# EAGLE board Luminant Display Rev. 2.0 Build 5 (FINAL) (EAGLE 6.4), part 1 of 13
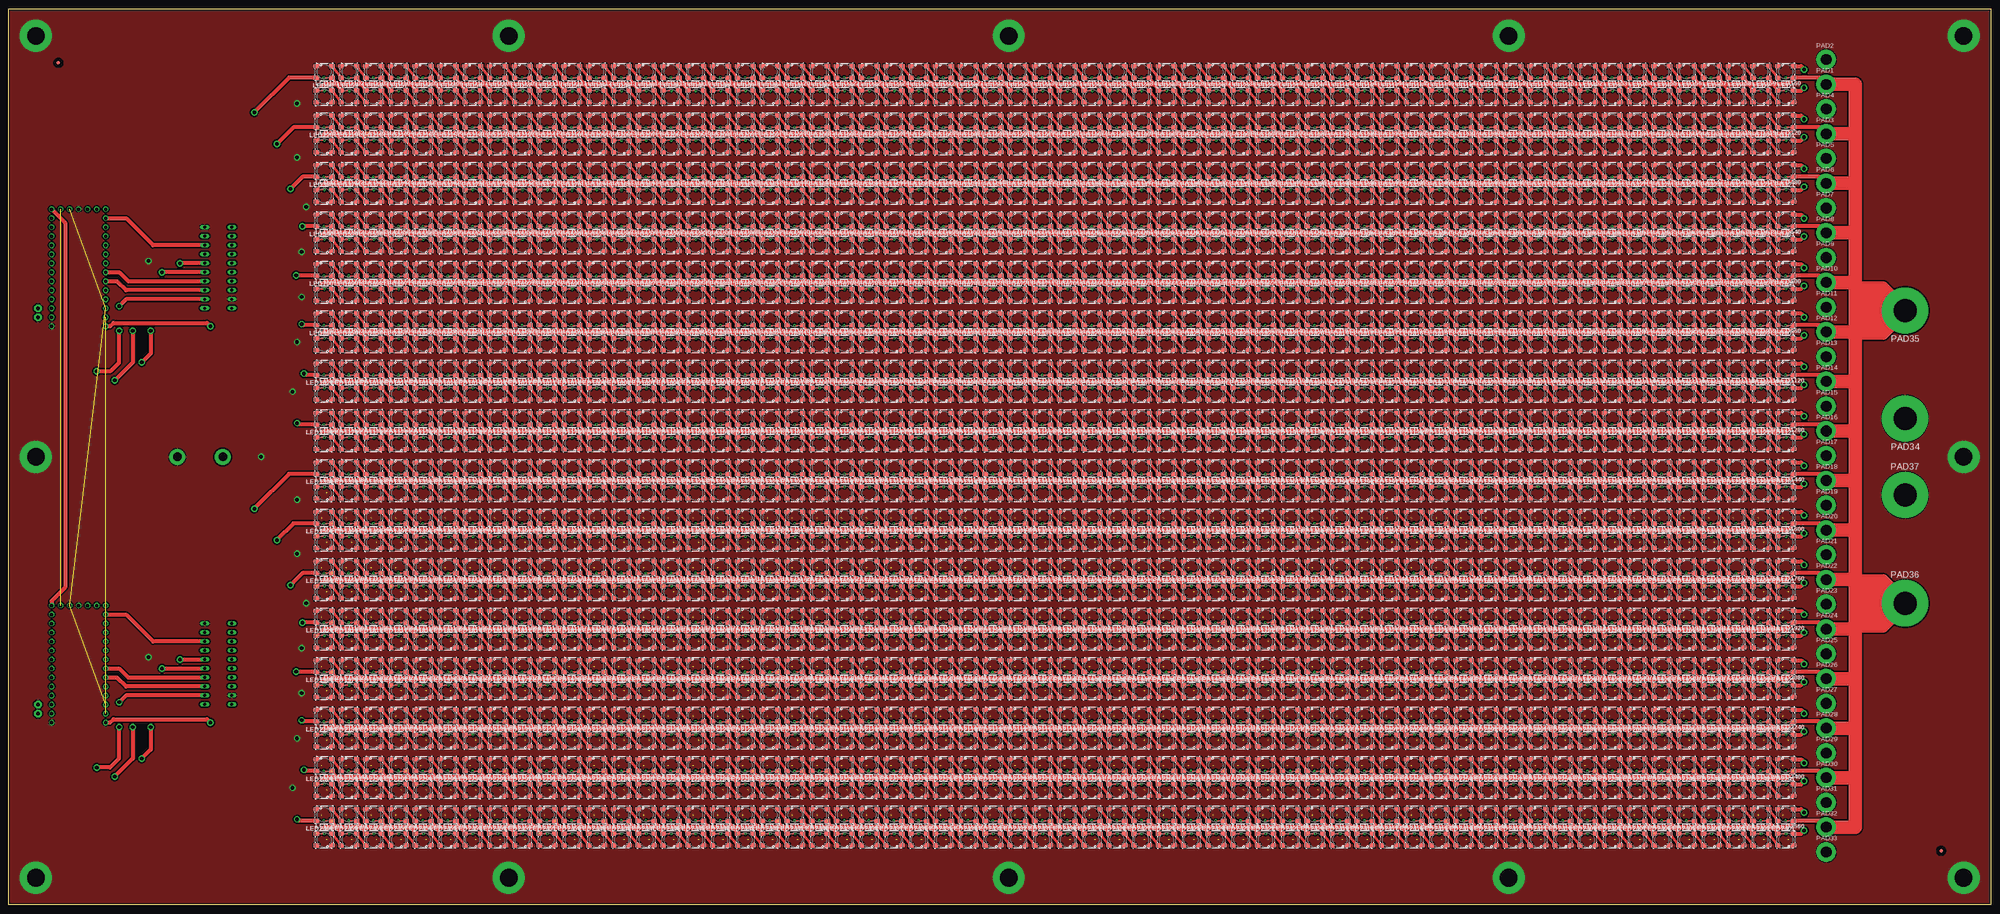
[diagram p9: board, top side]
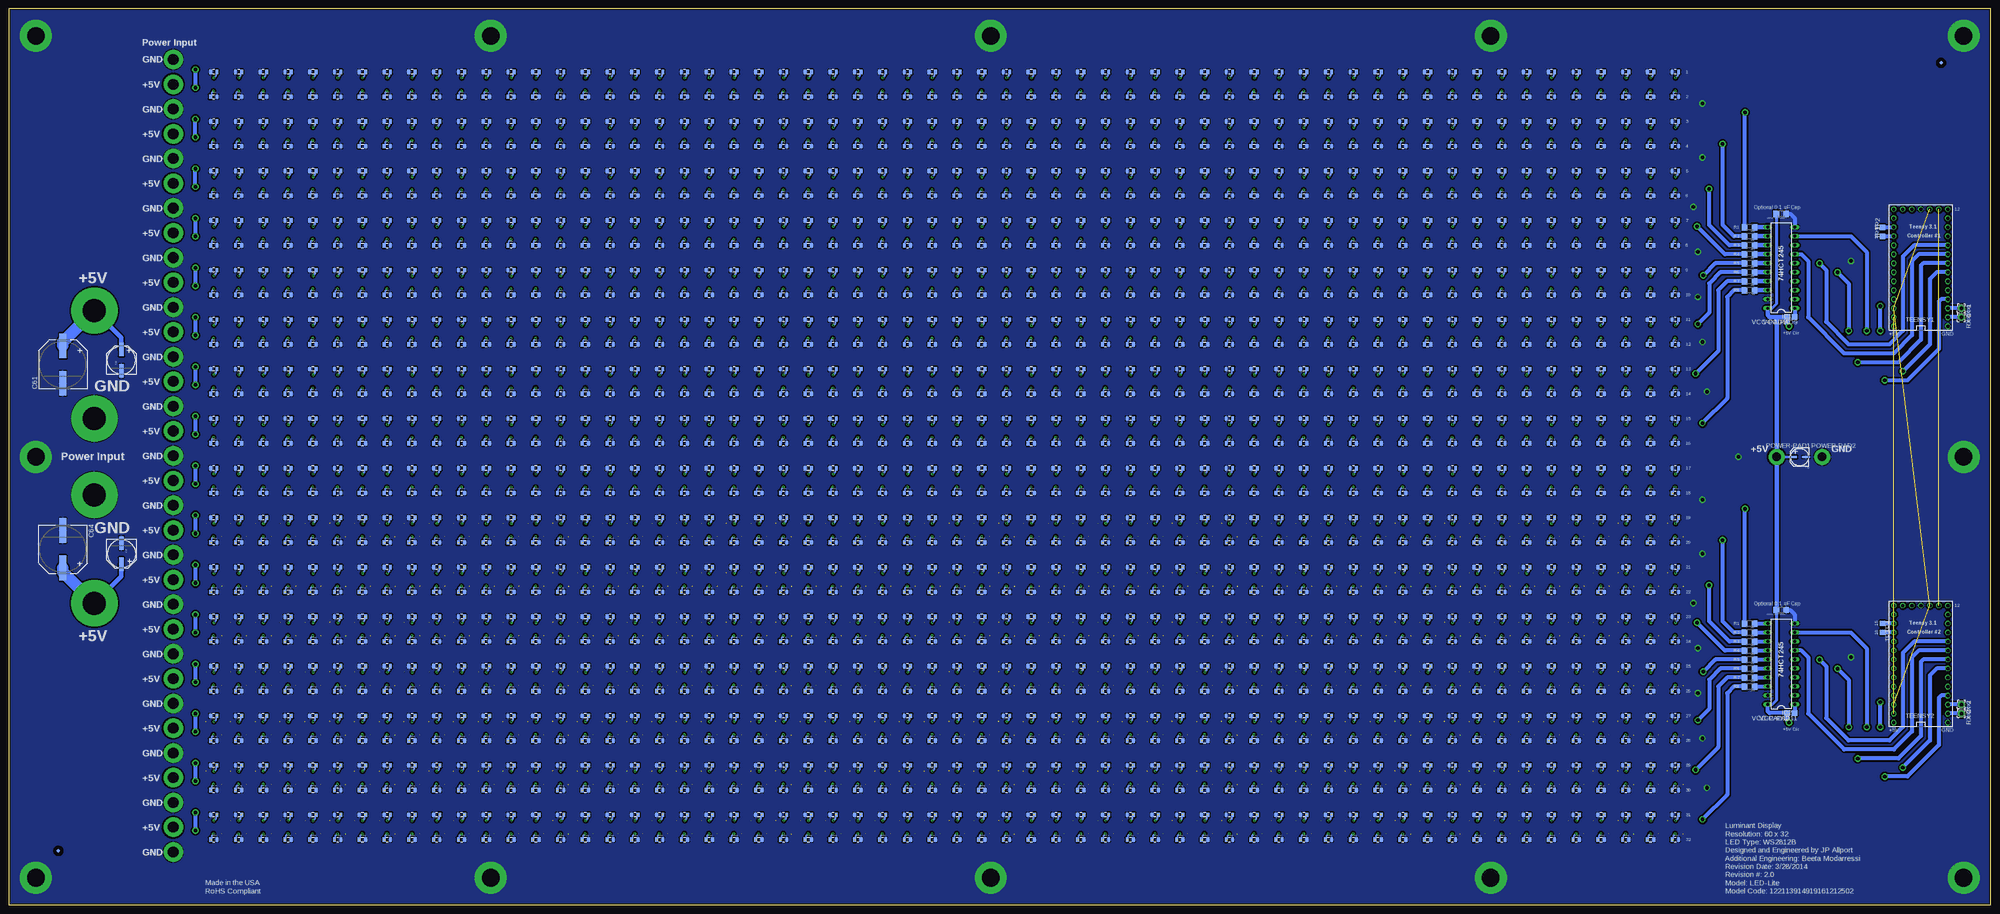
[diagram p10: board, bottom side, seen from below]

Size 558.8 x 252.73 mm. Coordinates in mm from the lower left corner, seen from the top.
Outline: 0,0 0,252.73 558.8,252.73 558.8,0 0,0
Copper layers (1*16): Top 0.035mm / dielectric 1.5mm / Bottom 0.035mm
Design rules "default *": minimum track width 10mil, minimum drill 10mil, track to track 14mil, track to pad 8mil, pad to pad 8mil, via to via 8mil, smd to smd 8mil, copper to edge 10mil, drill to drill 10mil, minimum pad ring 10mil, minimum via ring 8mil, stop-mask expansion 2mil, vias tented up to drill 0mil, thermal gap 10mil

## Footprints (pad centres in the part's own frame; a part is rotated, then mirrored left to right if it is on the bottom)
0805 = smd 0.8 x 1.2: 1 -0.9,0; 2 0.9,0
PANASONIC_FK_V_H = smd 7 x 2: + 5.3,0; - -5.3,0
PANASONIC_E = smd 3.8 x 1.4: + 3,0; - -3,0
PANASONIC_C = smd 2.2 x 0.65: + 1.9,-0.2; - -1.8,-0.2
1206 = smd 1.6 x 1.8: 1 -1.4,0; 2 1.4,0
DIL20 = drill 0.813 long: 1 -11.43,-3.81; 2 -8.89,-3.81; 3 -6.35,-3.81; 4 -3.81,-3.81; 5 -1.27,-3.81; 6 1.27,-3.81; 7 3.81,-3.81; 8 6.35,-3.81; 9 8.89,-3.81; 10 11.43,-3.81; 11 11.43,3.81; 12 8.89,3.81; 13 6.35,3.81; 14 3.81,3.81; 15 1.27,3.81; 16 -1.27,3.81; 17 -3.81,3.81; 18 -6.35,3.81; 19 -8.89,3.81; 20 -11.43,3.81
LED-WS2812B = smd 1.46 x 1.125: 1 -2.197,1.624; 2 -2.197,-1.624; 3 2.197,-1.624; 4 2.197,1.624
250,100 = drill 3 pad 5.5: 1 0,0
1000,400 = drill 6.5 pad 13: 1 0,0
125,50 = drill 2.413 pad 4.572: 1 0,0
2,15/1,0 = drill 1.016 pad 2.159 octagon: 1 0,0
TEENSY_3.1_BASIC = drill 0.965: 0 -7.62,13.97; 1 -7.62,11.43; 2 -7.62,8.89; 3 -7.62,6.35; 3.3V 7.62,11.43; 3.3V1 -2.54,-16.51; 4 -7.62,3.81; 5 -7.62,1.27; 6 -7.62,-1.27; 7 -7.62,-3.81; 8 -7.62,-6.35; 9 -7.62,-8.89; 10 -7.62,-11.43; 11 -7.62,-13.97; 12 -7.62,-16.51; 13 7.62,-16.51; 14/A0 7.62,-13.97; 15/A1 7.62,-11.43; 16/A2 7.62,-8.89; 17/A3 7.62,-6.35; 18/A4 7.62,-3.81; 19/A5 7.62,-1.27; 20/A6 7.62,1.27; 21/A7 7.62,3.81; 22/A8 7.62,6.35; 23/A9 7.62,8.89; A14 5.08,-16.51; AGND 7.62,13.97; GND -7.62,16.51; GND1 0,-16.51; PGM 2.54,-16.51; VBAT -5.08,-16.51; VIN 7.62,16.51
TP15SQ = smd 1.5 x 1.5: TP 0,0
FIDUCIAL_1MM = smd 1 x 1: 1 0,0

## Placement (x,y rotation side)
C1  0.1uF  [0805]  501.01,234.95 180 bottom
C2  0.1uF  [0805]  494.03,234.95 180 bottom
C3  0.1uF  [0805]  487.05,234.95 180 bottom
C4  0.1uF  [0805]  480.06,234.95 180 bottom
C5  0.1uF  [0805]  473.07,234.95 180 bottom
C6  0.1uF  [0805]  466.09,234.95 180 bottom
C7  0.1uF  [0805]  459.11,234.95 180 bottom
C8  0.1uF  [0805]  452.12,234.95 180 bottom
C9  0.1uF  [0805]  445.13,234.95 180 bottom
C10  0.1uF  [0805]  438.15,234.95 180 bottom
C11  0.1uF  [0805]  431.17,234.95 180 bottom
C12  0.1uF  [0805]  424.18,234.95 180 bottom
C13  0.1uF  [0805]  417.19,234.95 180 bottom
C14  0.1uF  [0805]  410.21,234.95 180 bottom
C15  0.1uF  [0805]  403.23,234.95 180 bottom
C16  0.1uF  [0805]  396.24,234.95 180 bottom
C17  0.1uF  [0805]  389.25,234.95 180 bottom
C18  0.1uF  [0805]  382.27,234.95 180 bottom
C19  0.1uF  [0805]  375.29,234.95 180 bottom
C20  0.1uF  [0805]  368.3,234.95 180 bottom
C21  0.1uF  [0805]  361.31,234.95 180 bottom
C22  0.1uF  [0805]  354.33,234.95 180 bottom
C23  0.1uF  [0805]  347.35,234.95 180 bottom
C24  0.1uF  [0805]  340.36,234.95 180 bottom
C25  0.1uF  [0805]  333.38,234.95 180 bottom
C26  0.1uF  [0805]  326.39,234.95 180 bottom
C27  0.1uF  [0805]  319.4,234.95 180 bottom
C28  0.1uF  [0805]  312.42,234.95 180 bottom
C29  0.1uF  [0805]  305.44,234.95 180 bottom
C30  0.1uF  [0805]  298.45,234.95 180 bottom
C31  0.1uF  [0805]  291.46,234.95 180 bottom
C32  0.1uF  [0805]  284.48,234.95 180 bottom
C33  0.1uF  [0805]  277.5,234.95 180 bottom
C34  0.1uF  [0805]  270.51,234.95 180 bottom
C35  0.1uF  [0805]  263.52,234.95 180 bottom
C36  0.1uF  [0805]  256.54,234.95 180 bottom
C37  0.1uF  [0805]  249.56,234.95 180 bottom
C38  0.1uF  [0805]  242.57,234.95 180 bottom
C39  0.1uF  [0805]  235.59,234.95 180 bottom
C40  0.1uF  [0805]  228.6,234.95 180 bottom
C41  0.1uF  [0805]  221.62,234.95 180 bottom
C42  0.1uF  [0805]  214.63,234.95 180 bottom
C43  0.1uF  [0805]  207.65,234.95 180 bottom
C44  0.1uF  [0805]  200.66,234.95 180 bottom
C45  0.1uF  [0805]  193.68,234.95 180 bottom
C46  0.1uF  [0805]  186.69,234.95 180 bottom
C47  0.1uF  [0805]  179.71,234.95 180 bottom
C48  0.1uF  [0805]  172.72,234.95 180 bottom
C49  0.1uF  [0805]  165.74,234.95 180 bottom
C50  0.1uF  [0805]  158.75,234.95 180 bottom
C51  0.1uF  [0805]  151.76,234.95 180 bottom
C52  0.1uF  [0805]  144.78,234.95 180 bottom
C53  0.1uF  [0805]  137.79,234.95 180 bottom
C54  0.1uF  [0805]  130.81,234.95 180 bottom
C55  0.1uF  [0805]  123.83,234.95 180 bottom
C56  0.1uF  [0805]  116.84,234.95 180 bottom
C57  0.1uF  [0805]  109.86,234.95 180 bottom
C58  0.1uF  [0805]  102.87,234.95 180 bottom
C59  0.1uF  [0805]  95.89,234.95 180 bottom
C60  0.1uF  [0805]  88.9,234.95 180 bottom
C61  [PANASONIC_FK_V_H]  543.56,152.4 90 bottom
C62  [PANASONIC_E]  527.05,153.67 90 bottom
C63  [PANASONIC_E]  527.05,99.06 270 bottom
C64  [PANASONIC_FK_V_H]  543.56,100.33 270 bottom
C65  [PANASONIC_C]  53.85,126.11 180 bottom
C101  0.1uF  [0805]  88.9,227.97 0 bottom
C102  0.1uF  [0805]  95.89,227.97 0 bottom
C103  0.1uF  [0805]  102.87,227.97 0 bottom
C104  0.1uF  [0805]  109.86,227.97 0 bottom
C105  0.1uF  [0805]  116.84,227.97 0 bottom
C106  0.1uF  [0805]  123.83,227.97 0 bottom
C107  0.1uF  [0805]  130.81,227.97 0 bottom
C108  0.1uF  [0805]  137.79,227.97 0 bottom
C109  0.1uF  [0805]  144.78,227.97 0 bottom
C110  0.1uF  [0805]  151.76,227.97 0 bottom
C111  0.1uF  [0805]  158.75,227.97 0 bottom
C112  0.1uF  [0805]  165.74,227.97 0 bottom
C113  0.1uF  [0805]  172.72,227.97 0 bottom
C114  0.1uF  [0805]  179.71,227.97 0 bottom
C115  0.1uF  [0805]  186.69,227.97 0 bottom
C116  0.1uF  [0805]  193.68,227.97 0 bottom
C117  0.1uF  [0805]  200.66,227.97 0 bottom
C118  0.1uF  [0805]  207.65,227.97 0 bottom
C119  0.1uF  [0805]  214.63,227.97 0 bottom
C120  0.1uF  [0805]  221.62,227.97 0 bottom
C121  0.1uF  [0805]  228.6,227.97 0 bottom
C122  0.1uF  [0805]  235.59,227.97 0 bottom
C123  0.1uF  [0805]  242.57,227.97 0 bottom
C124  0.1uF  [0805]  249.56,227.97 0 bottom
C125  0.1uF  [0805]  256.54,227.97 0 bottom
C126  0.1uF  [0805]  263.52,227.97 0 bottom
C127  0.1uF  [0805]  270.51,227.97 0 bottom
C128  0.1uF  [0805]  277.5,227.97 0 bottom
C129  0.1uF  [0805]  284.48,227.97 0 bottom
C130  0.1uF  [0805]  291.46,227.97 0 bottom
C131  0.1uF  [0805]  298.45,227.97 0 bottom
C132  0.1uF  [0805]  305.44,227.97 0 bottom
C133  0.1uF  [0805]  312.42,227.97 0 bottom
C134  0.1uF  [0805]  319.4,227.97 0 bottom
C135  0.1uF  [0805]  326.39,227.97 0 bottom
C136  0.1uF  [0805]  333.38,227.97 0 bottom
C137  0.1uF  [0805]  340.36,227.97 0 bottom
C138  0.1uF  [0805]  347.35,227.97 0 bottom
C139  0.1uF  [0805]  354.33,227.97 0 bottom
C140  0.1uF  [0805]  361.31,227.97 0 bottom
C141  0.1uF  [0805]  368.3,227.97 0 bottom
C142  0.1uF  [0805]  375.29,227.97 0 bottom
C143  0.1uF  [0805]  382.27,227.97 0 bottom
C144  0.1uF  [0805]  389.25,227.97 0 bottom
C145  0.1uF  [0805]  396.24,227.97 0 bottom
C146  0.1uF  [0805]  403.23,227.97 0 bottom
C147  0.1uF  [0805]  410.21,227.97 0 bottom
C148  0.1uF  [0805]  417.19,227.97 0 bottom
C149  0.1uF  [0805]  424.18,227.97 0 bottom
C150  0.1uF  [0805]  431.17,227.97 0 bottom
C151  0.1uF  [0805]  438.15,227.97 0 bottom
C152  0.1uF  [0805]  445.13,227.97 0 bottom
C153  0.1uF  [0805]  452.12,227.97 0 bottom
C154  0.1uF  [0805]  459.11,227.97 0 bottom
C155  0.1uF  [0805]  466.09,227.97 0 bottom
C156  0.1uF  [0805]  473.07,227.97 0 bottom
C157  0.1uF  [0805]  480.06,227.97 0 bottom
C158  0.1uF  [0805]  487.05,227.97 0 bottom
C159  0.1uF  [0805]  494.03,227.97 0 bottom
C160  0.1uF  [0805]  501.01,227.97 0 bottom
C161  0.1uF  [0805]  501.01,220.98 180 bottom
C162  0.1uF  [0805]  494.03,220.98 180 bottom
C163  0.1uF  [0805]  487.05,220.98 180 bottom
C164  0.1uF  [0805]  480.06,220.98 180 bottom
C165  0.1uF  [0805]  473.07,220.98 180 bottom
C166  0.1uF  [0805]  466.09,220.98 180 bottom
C167  0.1uF  [0805]  459.11,220.98 180 bottom
C168  0.1uF  [0805]  452.12,220.98 180 bottom
C169  0.1uF  [0805]  445.13,220.98 180 bottom
C170  0.1uF  [0805]  438.15,220.98 180 bottom
C171  0.1uF  [0805]  431.17,220.98 180 bottom
C172  0.1uF  [0805]  424.18,220.98 180 bottom
C173  0.1uF  [0805]  417.19,220.98 180 bottom
C174  0.1uF  [0805]  410.21,220.98 180 bottom
C175  0.1uF  [0805]  403.23,220.98 180 bottom
C176  0.1uF  [0805]  396.24,220.98 180 bottom
C177  0.1uF  [0805]  389.25,220.98 180 bottom
C178  0.1uF  [0805]  382.27,220.98 180 bottom
C179  0.1uF  [0805]  375.29,220.98 180 bottom
C180  0.1uF  [0805]  368.3,220.98 180 bottom
C181  0.1uF  [0805]  361.31,220.98 180 bottom
C182  0.1uF  [0805]  354.33,220.98 180 bottom
C183  0.1uF  [0805]  347.35,220.98 180 bottom
C184  0.1uF  [0805]  340.36,220.98 180 bottom
C185  0.1uF  [0805]  333.38,220.98 180 bottom
C186  0.1uF  [0805]  326.39,220.98 180 bottom
C187  0.1uF  [0805]  319.4,220.98 180 bottom
C188  0.1uF  [0805]  312.42,220.98 180 bottom
C189  0.1uF  [0805]  305.44,220.98 180 bottom
C190  0.1uF  [0805]  298.45,220.98 180 bottom
C191  0.1uF  [0805]  291.46,220.98 180 bottom
C192  0.1uF  [0805]  284.48,220.98 180 bottom
C193  0.1uF  [0805]  277.5,220.98 180 bottom
C194  0.1uF  [0805]  270.51,220.98 180 bottom
C195  0.1uF  [0805]  263.52,220.98 180 bottom
C196  0.1uF  [0805]  256.54,220.98 180 bottom
C197  0.1uF  [0805]  249.56,220.98 180 bottom
C198  0.1uF  [0805]  242.57,220.98 180 bottom
C199  0.1uF  [0805]  235.59,220.98 180 bottom
C200  0.1uF  [0805]  228.6,220.98 180 bottom
C201  0.1uF  [0805]  221.62,220.98 180 bottom
C202  0.1uF  [0805]  214.63,220.98 180 bottom
C203  0.1uF  [0805]  207.65,220.98 180 bottom
C204  0.1uF  [0805]  200.66,220.98 180 bottom
C205  0.1uF  [0805]  193.68,220.98 180 bottom
C206  0.1uF  [0805]  186.69,220.98 180 bottom
C207  0.1uF  [0805]  179.71,220.98 180 bottom
C208  0.1uF  [0805]  172.72,220.98 180 bottom
C209  0.1uF  [0805]  165.74,220.98 180 bottom
C210  0.1uF  [0805]  158.75,220.98 180 bottom
C211  0.1uF  [0805]  151.76,220.98 180 bottom
C212  0.1uF  [0805]  144.78,220.98 180 bottom
C213  0.1uF  [0805]  137.79,220.98 180 bottom
C214  0.1uF  [0805]  130.81,220.98 180 bottom
C215  0.1uF  [0805]  123.83,220.98 180 bottom
C216  0.1uF  [0805]  116.84,220.98 180 bottom
C217  0.1uF  [0805]  109.86,220.98 180 bottom
C218  0.1uF  [0805]  102.87,220.98 180 bottom
C219  0.1uF  [0805]  95.89,220.98 180 bottom
C220  0.1uF  [0805]  88.9,220.98 180 bottom
C261  0.1uF  [0805]  88.9,214 0 bottom
C262  0.1uF  [0805]  95.89,214 0 bottom
C263  0.1uF  [0805]  102.87,214 0 bottom
C264  0.1uF  [0805]  109.86,214 0 bottom
C265  0.1uF  [0805]  116.84,214 0 bottom
C266  0.1uF  [0805]  123.83,214 0 bottom
C267  0.1uF  [0805]  130.81,214 0 bottom
C268  0.1uF  [0805]  137.79,214 0 bottom
C269  0.1uF  [0805]  144.78,214 0 bottom
C270  0.1uF  [0805]  151.76,214 0 bottom
C271  0.1uF  [0805]  158.75,214 0 bottom
C272  0.1uF  [0805]  165.74,214 0 bottom
C273  0.1uF  [0805]  172.72,214 0 bottom
C274  0.1uF  [0805]  179.71,214 0 bottom
C275  0.1uF  [0805]  186.69,214 0 bottom
C276  0.1uF  [0805]  193.68,214 0 bottom
C277  0.1uF  [0805]  200.66,214 0 bottom
C278  0.1uF  [0805]  207.65,214 0 bottom
C279  0.1uF  [0805]  214.63,214 0 bottom
C280  0.1uF  [0805]  221.62,214 0 bottom
C281  0.1uF  [0805]  228.6,214 0 bottom
C282  0.1uF  [0805]  235.59,214 0 bottom
C283  0.1uF  [0805]  242.57,214 0 bottom
C284  0.1uF  [0805]  249.56,214 0 bottom
C285  0.1uF  [0805]  256.54,214 0 bottom
C286  0.1uF  [0805]  263.52,214 0 bottom
C287  0.1uF  [0805]  270.51,214 0 bottom
C288  0.1uF  [0805]  277.5,214 0 bottom
C289  0.1uF  [0805]  284.48,214 0 bottom
C290  0.1uF  [0805]  291.46,214 0 bottom
C291  0.1uF  [0805]  298.45,214 0 bottom
C292  0.1uF  [0805]  305.44,214 0 bottom
C293  0.1uF  [0805]  312.42,214 0 bottom
C294  0.1uF  [0805]  319.4,214 0 bottom
C295  0.1uF  [0805]  326.39,214 0 bottom
C296  0.1uF  [0805]  333.38,214 0 bottom
C297  0.1uF  [0805]  340.36,214 0 bottom
C298  0.1uF  [0805]  347.35,214 0 bottom
C299  0.1uF  [0805]  354.33,214 0 bottom
C300  0.1uF  [0805]  361.31,214 0 bottom
C301  0.1uF  [0805]  368.3,214 0 bottom
C302  0.1uF  [0805]  375.29,214 0 bottom
C303  0.1uF  [0805]  382.27,214 0 bottom
C304  0.1uF  [0805]  389.25,214 0 bottom
C305  0.1uF  [0805]  396.24,214 0 bottom
C306  0.1uF  [0805]  403.23,214 0 bottom
C307  0.1uF  [0805]  410.21,214 0 bottom
C308  0.1uF  [0805]  417.19,214 0 bottom
C309  0.1uF  [0805]  424.18,214 0 bottom
C310  0.1uF  [0805]  431.17,214 0 bottom
C311  0.1uF  [0805]  438.15,214 0 bottom
C312  0.1uF  [0805]  445.13,214 0 bottom
C313  0.1uF  [0805]  452.12,214 0 bottom
C314  0.1uF  [0805]  459.11,214 0 bottom
C315  0.1uF  [0805]  466.09,214 0 bottom
C316  0.1uF  [0805]  473.07,214 0 bottom
C317  0.1uF  [0805]  480.06,214 0 bottom
C318  0.1uF  [0805]  487.05,214 0 bottom
C319  0.1uF  [0805]  494.03,214 0 bottom
C320  0.1uF  [0805]  501.01,214 0 bottom
C321  0.1uF  [0805]  501.01,207.01 180 bottom
C322  0.1uF  [0805]  494.03,207.01 180 bottom
C323  0.1uF  [0805]  487.05,207.01 180 bottom
C324  0.1uF  [0805]  480.06,207.01 180 bottom
C325  0.1uF  [0805]  473.07,207.01 180 bottom
C326  0.1uF  [0805]  466.09,207.01 180 bottom
C327  0.1uF  [0805]  459.11,207.01 180 bottom
C328  0.1uF  [0805]  452.12,207.01 180 bottom
C329  0.1uF  [0805]  445.13,207.01 180 bottom
C330  0.1uF  [0805]  438.15,207.01 180 bottom
C331  0.1uF  [0805]  431.17,207.01 180 bottom
C332  0.1uF  [0805]  424.18,207.01 180 bottom
C333  0.1uF  [0805]  417.19,207.01 180 bottom
C334  0.1uF  [0805]  410.21,207.01 180 bottom
C335  0.1uF  [0805]  403.23,207.01 180 bottom
C336  0.1uF  [0805]  396.24,207.01 180 bottom
C337  0.1uF  [0805]  389.25,207.01 180 bottom
C338  0.1uF  [0805]  382.27,207.01 180 bottom
C339  0.1uF  [0805]  375.29,207.01 180 bottom
C340  0.1uF  [0805]  368.3,207.01 180 bottom
C341  0.1uF  [0805]  361.31,207.01 180 bottom
C342  0.1uF  [0805]  354.33,207.01 180 bottom
C343  0.1uF  [0805]  347.35,207.01 180 bottom
C344  0.1uF  [0805]  340.36,207.01 180 bottom
C345  0.1uF  [0805]  333.38,207.01 180 bottom
C346  0.1uF  [0805]  326.39,207.01 180 bottom
C347  0.1uF  [0805]  319.4,207.01 180 bottom
C348  0.1uF  [0805]  312.42,207.01 180 bottom
C349  0.1uF  [0805]  305.44,207.01 180 bottom
C350  0.1uF  [0805]  298.45,207.01 180 bottom
C351  0.1uF  [0805]  291.46,207.01 180 bottom
C352  0.1uF  [0805]  284.48,207.01 180 bottom
C353  0.1uF  [0805]  277.5,207.01 180 bottom
C354  0.1uF  [0805]  270.51,207.01 180 bottom
C355  0.1uF  [0805]  263.52,207.01 180 bottom
C356  0.1uF  [0805]  256.54,207.01 180 bottom
C357  0.1uF  [0805]  249.56,207.01 180 bottom
C358  0.1uF  [0805]  242.57,207.01 180 bottom
C359  0.1uF  [0805]  235.59,207.01 180 bottom
C360  0.1uF  [0805]  228.6,207.01 180 bottom
C361  0.1uF  [0805]  221.62,207.01 180 bottom
C362  0.1uF  [0805]  214.63,207.01 180 bottom
C363  0.1uF  [0805]  207.65,207.01 180 bottom
C364  0.1uF  [0805]  200.66,207.01 180 bottom
C365  0.1uF  [0805]  193.68,207.01 180 bottom
C366  0.1uF  [0805]  186.69,207.01 180 bottom
C367  0.1uF  [0805]  179.71,207.01 180 bottom
C368  0.1uF  [0805]  172.72,207.01 180 bottom
C369  0.1uF  [0805]  165.74,207.01 180 bottom
C370  0.1uF  [0805]  158.75,207.01 180 bottom
C371  0.1uF  [0805]  151.76,207.01 180 bottom
C372  0.1uF  [0805]  144.78,207.01 180 bottom
C373  0.1uF  [0805]  137.79,207.01 180 bottom
C374  0.1uF  [0805]  130.81,207.01 180 bottom
C375  0.1uF  [0805]  123.83,207.01 180 bottom
C376  0.1uF  [0805]  116.84,207.01 180 bottom
C377  0.1uF  [0805]  109.86,207.01 180 bottom
C378  0.1uF  [0805]  102.87,207.01 180 bottom
C379  0.1uF  [0805]  95.89,207.01 180 bottom
C380  0.1uF  [0805]  88.9,207.01 180 bottom
C421  0.1uF  [0805]  88.9,200.03 0 bottom
C422  0.1uF  [0805]  95.89,200.03 0 bottom
C423  0.1uF  [0805]  102.87,200.03 0 bottom
C424  0.1uF  [0805]  109.86,200.03 0 bottom
C425  0.1uF  [0805]  116.84,200.03 0 bottom
C426  0.1uF  [0805]  123.83,200.03 0 bottom
C427  0.1uF  [0805]  130.81,200.03 0 bottom
C428  0.1uF  [0805]  137.79,200.03 0 bottom
C429  0.1uF  [0805]  144.78,200.03 0 bottom
C430  0.1uF  [0805]  151.76,200.03 0 bottom
C431  0.1uF  [0805]  158.75,200.03 0 bottom
C432  0.1uF  [0805]  165.74,200.03 0 bottom
C433  0.1uF  [0805]  172.72,200.03 0 bottom
C434  0.1uF  [0805]  179.71,200.03 0 bottom
C435  0.1uF  [0805]  186.69,200.03 0 bottom
C436  0.1uF  [0805]  193.68,200.03 0 bottom
C437  0.1uF  [0805]  200.66,200.03 0 bottom
C438  0.1uF  [0805]  207.65,200.03 0 bottom
C439  0.1uF  [0805]  214.63,200.03 0 bottom
C440  0.1uF  [0805]  221.62,200.03 0 bottom
C441  0.1uF  [0805]  228.6,200.03 0 bottom
C442  0.1uF  [0805]  235.59,200.03 0 bottom
C443  0.1uF  [0805]  242.57,200.03 0 bottom
C444  0.1uF  [0805]  249.56,200.03 0 bottom
C445  0.1uF  [0805]  256.54,200.03 0 bottom
C446  0.1uF  [0805]  263.52,200.03 0 bottom
C447  0.1uF  [0805]  270.51,200.03 0 bottom
C448  0.1uF  [0805]  277.5,200.03 0 bottom
C449  0.1uF  [0805]  284.48,200.03 0 bottom
C450  0.1uF  [0805]  291.46,200.03 0 bottom
C451  0.1uF  [0805]  298.45,200.03 0 bottom
C452  0.1uF  [0805]  305.44,200.03 0 bottom
C453  0.1uF  [0805]  312.42,200.03 0 bottom
C454  0.1uF  [0805]  319.4,200.03 0 bottom
C455  0.1uF  [0805]  326.39,200.03 0 bottom
C456  0.1uF  [0805]  333.38,200.03 0 bottom
C457  0.1uF  [0805]  340.36,200.03 0 bottom
C458  0.1uF  [0805]  347.35,200.03 0 bottom
C459  0.1uF  [0805]  354.33,200.03 0 bottom
C460  0.1uF  [0805]  361.31,200.03 0 bottom
C461  0.1uF  [0805]  368.3,200.03 0 bottom
C462  0.1uF  [0805]  375.29,200.03 0 bottom
C463  0.1uF  [0805]  382.27,200.03 0 bottom
C464  0.1uF  [0805]  389.25,200.03 0 bottom
C465  0.1uF  [0805]  396.24,200.03 0 bottom
C466  0.1uF  [0805]  403.23,200.03 0 bottom
C467  0.1uF  [0805]  410.21,200.03 0 bottom
C468  0.1uF  [0805]  417.19,200.03 0 bottom
C469  0.1uF  [0805]  424.18,200.03 0 bottom
C470  0.1uF  [0805]  431.17,200.03 0 bottom
C471  0.1uF  [0805]  438.15,200.03 0 bottom
C472  0.1uF  [0805]  445.13,200.03 0 bottom
C473  0.1uF  [0805]  452.12,200.03 0 bottom
C474  0.1uF  [0805]  459.11,200.03 0 bottom
C475  0.1uF  [0805]  466.09,200.03 0 bottom
C476  0.1uF  [0805]  473.07,200.03 0 bottom
C477  0.1uF  [0805]  480.06,200.03 0 bottom
C478  0.1uF  [0805]  487.05,200.03 0 bottom
C479  0.1uF  [0805]  494.03,200.03 0 bottom
C480  0.1uF  [0805]  501.01,200.03 0 bottom
C481  0.1uF  [0805]  501.01,193.04 180 bottom
C482  0.1uF  [0805]  494.03,193.04 180 bottom
C483  0.1uF  [0805]  487.05,193.04 180 bottom
C484  0.1uF  [0805]  480.06,193.04 180 bottom
C485  0.1uF  [0805]  473.07,193.04 180 bottom
C486  0.1uF  [0805]  466.09,193.04 180 bottom
C487  0.1uF  [0805]  459.11,193.04 180 bottom
C488  0.1uF  [0805]  452.12,193.04 180 bottom
C489  0.1uF  [0805]  445.13,193.04 180 bottom
C490  0.1uF  [0805]  438.15,193.04 180 bottom
C491  0.1uF  [0805]  431.17,193.04 180 bottom
C492  0.1uF  [0805]  424.18,193.04 180 bottom
C493  0.1uF  [0805]  417.19,193.04 180 bottom
C494  0.1uF  [0805]  410.21,193.04 180 bottom
C495  0.1uF  [0805]  403.23,193.04 180 bottom
C496  0.1uF  [0805]  396.24,193.04 180 bottom
C497  0.1uF  [0805]  389.25,193.04 180 bottom
C498  0.1uF  [0805]  382.27,193.04 180 bottom
C499  0.1uF  [0805]  375.29,193.04 180 bottom
C500  0.1uF  [0805]  368.3,193.04 180 bottom
C501  0.1uF  [0805]  361.31,193.04 180 bottom
C502  0.1uF  [0805]  354.33,193.04 180 bottom
C503  0.1uF  [0805]  347.35,193.04 180 bottom
C504  0.1uF  [0805]  340.36,193.04 180 bottom
C505  0.1uF  [0805]  333.38,193.04 180 bottom
C506  0.1uF  [0805]  326.39,193.04 180 bottom
C507  0.1uF  [0805]  319.4,193.04 180 bottom
C508  0.1uF  [0805]  312.42,193.04 180 bottom
C509  0.1uF  [0805]  305.44,193.04 180 bottom
C510  0.1uF  [0805]  298.45,193.04 180 bottom
C511  0.1uF  [0805]  291.46,193.04 180 bottom
C512  0.1uF  [0805]  284.48,193.04 180 bottom
C513  0.1uF  [0805]  277.5,193.04 180 bottom
C514  0.1uF  [0805]  270.51,193.04 180 bottom
C515  0.1uF  [0805]  263.52,193.04 180 bottom
C516  0.1uF  [0805]  256.54,193.04 180 bottom
C517  0.1uF  [0805]  249.56,193.04 180 bottom
C518  0.1uF  [0805]  242.57,193.04 180 bottom
C519  0.1uF  [0805]  235.59,193.04 180 bottom
C520  0.1uF  [0805]  228.6,193.04 180 bottom
C521  0.1uF  [0805]  221.62,193.04 180 bottom
C522  0.1uF  [0805]  214.63,193.04 180 bottom
C523  0.1uF  [0805]  207.65,193.04 180 bottom
C524  0.1uF  [0805]  200.66,193.04 180 bottom
C525  0.1uF  [0805]  193.68,193.04 180 bottom
C526  0.1uF  [0805]  186.69,193.04 180 bottom
C527  0.1uF  [0805]  179.71,193.04 180 bottom
C528  0.1uF  [0805]  172.72,193.04 180 bottom
C529  0.1uF  [0805]  165.74,193.04 180 bottom
C530  0.1uF  [0805]  158.75,193.04 180 bottom
C531  0.1uF  [0805]  151.76,193.04 180 bottom
C532  0.1uF  [0805]  144.78,193.04 180 bottom
C533  0.1uF  [0805]  137.79,193.04 180 bottom
C534  0.1uF  [0805]  130.81,193.04 180 bottom
C535  0.1uF  [0805]  123.83,193.04 180 bottom
C536  0.1uF  [0805]  116.84,193.04 180 bottom
C537  0.1uF  [0805]  109.86,193.04 180 bottom
C538  0.1uF  [0805]  102.87,193.04 180 bottom
C539  0.1uF  [0805]  95.89,193.04 180 bottom
C540  0.1uF  [0805]  88.9,193.04 180 bottom
C581  0.1uF  [0805]  88.9,186.06 0 bottom
C582  0.1uF  [0805]  95.89,186.06 0 bottom
C583  0.1uF  [0805]  102.87,186.06 0 bottom
C584  0.1uF  [0805]  109.86,186.06 0 bottom
C585  0.1uF  [0805]  116.84,186.06 0 bottom
C586  0.1uF  [0805]  123.83,186.06 0 bottom
C587  0.1uF  [0805]  130.81,186.06 0 bottom
C588  0.1uF  [0805]  137.79,186.06 0 bottom
C589  0.1uF  [0805]  144.78,186.06 0 bottom
C590  0.1uF  [0805]  151.76,186.06 0 bottom
C591  0.1uF  [0805]  158.75,186.06 0 bottom
C592  0.1uF  [0805]  165.74,186.06 0 bottom
C593  0.1uF  [0805]  172.72,186.06 0 bottom
C594  0.1uF  [0805]  179.71,186.06 0 bottom
C595  0.1uF  [0805]  186.69,186.06 0 bottom
C596  0.1uF  [0805]  193.68,186.06 0 bottom
C597  0.1uF  [0805]  200.66,186.06 0 bottom
C598  0.1uF  [0805]  207.65,186.06 0 bottom
C599  0.1uF  [0805]  214.63,186.06 0 bottom
C600  0.1uF  [0805]  221.62,186.06 0 bottom
C601  0.1uF  [0805]  228.6,186.06 0 bottom
C602  0.1uF  [0805]  235.59,186.06 0 bottom
C603  0.1uF  [0805]  242.57,186.06 0 bottom
C604  0.1uF  [0805]  249.56,186.06 0 bottom
C605  0.1uF  [0805]  256.54,186.06 0 bottom
C606  0.1uF  [0805]  263.52,186.06 0 bottom
C607  0.1uF  [0805]  270.51,186.06 0 bottom
C608  0.1uF  [0805]  277.5,186.06 0 bottom
C609  0.1uF  [0805]  284.48,186.06 0 bottom
C610  0.1uF  [0805]  291.46,186.06 0 bottom
C611  0.1uF  [0805]  298.45,186.06 0 bottom
C612  0.1uF  [0805]  305.44,186.06 0 bottom
C613  0.1uF  [0805]  312.42,186.06 0 bottom
C614  0.1uF  [0805]  319.4,186.06 0 bottom
C615  0.1uF  [0805]  326.39,186.06 0 bottom
C616  0.1uF  [0805]  333.38,186.06 0 bottom
C617  0.1uF  [0805]  340.36,186.06 0 bottom
C618  0.1uF  [0805]  347.35,186.06 0 bottom
C619  0.1uF  [0805]  354.33,186.06 0 bottom
C620  0.1uF  [0805]  361.31,186.06 0 bottom
C621  0.1uF  [0805]  368.3,186.06 0 bottom
C622  0.1uF  [0805]  375.29,186.06 0 bottom
C623  0.1uF  [0805]  382.27,186.06 0 bottom
C624  0.1uF  [0805]  389.25,186.06 0 bottom
C625  0.1uF  [0805]  396.24,186.06 0 bottom
C626  0.1uF  [0805]  403.23,186.06 0 bottom
C627  0.1uF  [0805]  410.21,186.06 0 bottom
C628  0.1uF  [0805]  417.19,186.06 0 bottom
C629  0.1uF  [0805]  424.18,186.06 0 bottom
C630  0.1uF  [0805]  431.17,186.06 0 bottom
C631  0.1uF  [0805]  438.15,186.06 0 bottom
C632  0.1uF  [0805]  445.13,186.06 0 bottom
C633  0.1uF  [0805]  452.12,186.06 0 bottom
C634  0.1uF  [0805]  459.11,186.06 0 bottom
C635  0.1uF  [0805]  466.09,186.06 0 bottom
C636  0.1uF  [0805]  473.07,186.06 0 bottom
C637  0.1uF  [0805]  480.06,186.06 0 bottom
C638  0.1uF  [0805]  487.05,186.06 0 bottom
C639  0.1uF  [0805]  494.03,186.06 0 bottom
C640  0.1uF  [0805]  501.01,186.06 0 bottom
C641  0.1uF  [0805]  501.01,179.07 180 bottom
C642  0.1uF  [0805]  494.03,179.07 180 bottom
C643  0.1uF  [0805]  487.05,179.07 180 bottom
C644  0.1uF  [0805]  480.06,179.07 180 bottom
C645  0.1uF  [0805]  473.07,179.07 180 bottom
C646  0.1uF  [0805]  466.09,179.07 180 bottom
C647  0.1uF  [0805]  459.11,179.07 180 bottom
C648  0.1uF  [0805]  452.12,179.07 180 bottom
C649  0.1uF  [0805]  445.13,179.07 180 bottom
C650  0.1uF  [0805]  438.15,179.07 180 bottom
C651  0.1uF  [0805]  431.17,179.07 180 bottom
C652  0.1uF  [0805]  424.18,179.07 180 bottom
C653  0.1uF  [0805]  417.19,179.07 180 bottom
C654  0.1uF  [0805]  410.21,179.07 180 bottom
C655  0.1uF  [0805]  403.23,179.07 180 bottom
C656  0.1uF  [0805]  396.24,179.07 180 bottom
C657  0.1uF  [0805]  389.25,179.07 180 bottom
C658  0.1uF  [0805]  382.27,179.07 180 bottom
C659  0.1uF  [0805]  375.29,179.07 180 bottom
C660  0.1uF  [0805]  368.3,179.07 180 bottom
C661  0.1uF  [0805]  361.31,179.07 180 bottom
C662  0.1uF  [0805]  354.33,179.07 180 bottom
C663  0.1uF  [0805]  347.35,179.07 180 bottom
C664  0.1uF  [0805]  340.36,179.07 180 bottom
C665  0.1uF  [0805]  333.38,179.07 180 bottom
C666  0.1uF  [0805]  326.39,179.07 180 bottom
C667  0.1uF  [0805]  319.4,179.07 180 bottom
C668  0.1uF  [0805]  312.42,179.07 180 bottom
C669  0.1uF  [0805]  305.44,179.07 180 bottom
C670  0.1uF  [0805]  298.45,179.07 180 bottom
C671  0.1uF  [0805]  291.46,179.07 180 bottom
C672  0.1uF  [0805]  284.48,179.07 180 bottom
C673  0.1uF  [0805]  277.5,179.07 180 bottom
C674  0.1uF  [0805]  270.51,179.07 180 bottom
C675  0.1uF  [0805]  263.52,179.07 180 bottom
C676  0.1uF  [0805]  256.54,179.07 180 bottom
C677  0.1uF  [0805]  249.56,179.07 180 bottom
C678  0.1uF  [0805]  242.57,179.07 180 bottom
C679  0.1uF  [0805]  235.59,179.07 180 bottom
C680  0.1uF  [0805]  228.6,179.07 180 bottom
C681  0.1uF  [0805]  221.62,179.07 180 bottom
C682  0.1uF  [0805]  214.63,179.07 180 bottom
C683  0.1uF  [0805]  207.65,179.07 180 bottom
C684  0.1uF  [0805]  200.66,179.07 180 bottom
C685  0.1uF  [0805]  193.68,179.07 180 bottom
C686  0.1uF  [0805]  186.69,179.07 180 bottom
C687  0.1uF  [0805]  179.71,179.07 180 bottom
C688  0.1uF  [0805]  172.72,179.07 180 bottom
C689  0.1uF  [0805]  165.74,179.07 180 bottom
C690  0.1uF  [0805]  158.75,179.07 180 bottom
C691  0.1uF  [0805]  151.76,179.07 180 bottom
C692  0.1uF  [0805]  144.78,179.07 180 bottom
C693  0.1uF  [0805]  137.79,179.07 180 bottom
C694  0.1uF  [0805]  130.81,179.07 180 bottom
C695  0.1uF  [0805]  123.83,179.07 180 bottom
C696  0.1uF  [0805]  116.84,179.07 180 bottom
C697  0.1uF  [0805]  109.86,179.07 180 bottom
C698  0.1uF  [0805]  102.87,179.07 180 bottom
C699  0.1uF  [0805]  95.89,179.07 180 bottom
C700  0.1uF  [0805]  88.9,179.07 180 bottom
C741  0.1uF  [0805]  88.9,172.09 0 bottom
C742  0.1uF  [0805]  95.89,172.09 0 bottom
C743  0.1uF  [0805]  102.87,172.09 0 bottom
C744  0.1uF  [0805]  109.86,172.09 0 bottom
C745  0.1uF  [0805]  116.84,172.09 0 bottom
C746  0.1uF  [0805]  123.83,172.09 0 bottom
C747  0.1uF  [0805]  130.81,172.09 0 bottom
C748  0.1uF  [0805]  137.79,172.09 0 bottom
C749  0.1uF  [0805]  144.78,172.09 0 bottom
C750  0.1uF  [0805]  151.76,172.09 0 bottom
C751  0.1uF  [0805]  158.75,172.09 0 bottom
C752  0.1uF  [0805]  165.74,172.09 0 bottom
C753  0.1uF  [0805]  172.72,172.09 0 bottom
C754  0.1uF  [0805]  179.71,172.09 0 bottom
C755  0.1uF  [0805]  186.69,172.09 0 bottom
C756  0.1uF  [0805]  193.68,172.09 0 bottom
C757  0.1uF  [0805]  200.66,172.09 0 bottom
C758  0.1uF  [0805]  207.65,172.09 0 bottom
C759  0.1uF  [0805]  214.63,172.09 0 bottom
C760  0.1uF  [0805]  221.62,172.09 0 bottom
C761  0.1uF  [0805]  228.6,172.09 0 bottom
C762  0.1uF  [0805]  235.59,172.09 0 bottom
C763  0.1uF  [0805]  242.57,172.09 0 bottom
C764  0.1uF  [0805]  249.56,172.09 0 bottom
C765  0.1uF  [0805]  256.54,172.09 0 bottom
C766  0.1uF  [0805]  263.52,172.09 0 bottom
C767  0.1uF  [0805]  270.51,172.09 0 bottom
C768  0.1uF  [0805]  277.5,172.09 0 bottom
C769  0.1uF  [0805]  284.48,172.09 0 bottom
C770  0.1uF  [0805]  291.46,172.09 0 bottom
C771  0.1uF  [0805]  298.45,172.09 0 bottom
C772  0.1uF  [0805]  305.44,172.09 0 bottom
C773  0.1uF  [0805]  312.42,172.09 0 bottom
C774  0.1uF  [0805]  319.4,172.09 0 bottom
C775  0.1uF  [0805]  326.39,172.09 0 bottom
C776  0.1uF  [0805]  333.38,172.09 0 bottom
C777  0.1uF  [0805]  340.36,172.09 0 bottom
C778  0.1uF  [0805]  347.35,172.09 0 bottom
C779  0.1uF  [0805]  354.33,172.09 0 bottom
C780  0.1uF  [0805]  361.31,172.09 0 bottom
C781  0.1uF  [0805]  368.3,172.09 0 bottom
C782  0.1uF  [0805]  375.29,172.09 0 bottom
C783  0.1uF  [0805]  382.27,172.09 0 bottom
C784  0.1uF  [0805]  389.25,172.09 0 bottom
C785  0.1uF  [0805]  396.24,172.09 0 bottom
C786  0.1uF  [0805]  403.23,172.09 0 bottom
C787  0.1uF  [0805]  410.21,172.09 0 bottom
C788  0.1uF  [0805]  417.19,172.09 0 bottom
C789  0.1uF  [0805]  424.18,172.09 0 bottom
C790  0.1uF  [0805]  431.17,172.09 0 bottom
C791  0.1uF  [0805]  438.15,172.09 0 bottom
C792  0.1uF  [0805]  445.13,172.09 0 bottom
C793  0.1uF  [0805]  452.12,172.09 0 bottom
C794  0.1uF  [0805]  459.11,172.09 0 bottom
C795  0.1uF  [0805]  466.09,172.09 0 bottom
C796  0.1uF  [0805]  473.07,172.09 0 bottom
C797  0.1uF  [0805]  480.06,172.09 0 bottom
C798  0.1uF  [0805]  487.05,172.09 0 bottom
C799  0.1uF  [0805]  494.03,172.09 0 bottom
C800  0.1uF  [0805]  501.01,172.09 0 bottom
C801  0.1uF  [0805]  501.01,165.1 180 bottom
C802  0.1uF  [0805]  494.03,165.1 180 bottom
C803  0.1uF  [0805]  487.05,165.1 180 bottom
C804  0.1uF  [0805]  480.06,165.1 180 bottom
C805  0.1uF  [0805]  473.07,165.1 180 bottom
C806  0.1uF  [0805]  466.09,165.1 180 bottom
C807  0.1uF  [0805]  459.11,165.1 180 bottom
C808  0.1uF  [0805]  452.12,165.1 180 bottom
C809  0.1uF  [0805]  445.13,165.1 180 bottom
C810  0.1uF  [0805]  438.15,165.1 180 bottom
C811  0.1uF  [0805]  431.17,165.1 180 bottom
C812  0.1uF  [0805]  424.18,165.1 180 bottom
C813  0.1uF  [0805]  417.19,165.1 180 bottom
C814  0.1uF  [0805]  410.21,165.1 180 bottom
C815  0.1uF  [0805]  403.23,165.1 180 bottom
C816  0.1uF  [0805]  396.24,165.1 180 bottom
C817  0.1uF  [0805]  389.25,165.1 180 bottom
C818  0.1uF  [0805]  382.27,165.1 180 bottom
C819  0.1uF  [0805]  375.29,165.1 180 bottom
C820  0.1uF  [0805]  368.3,165.1 180 bottom
C821  0.1uF  [0805]  361.31,165.1 180 bottom
C822  0.1uF  [0805]  354.33,165.1 180 bottom
C823  0.1uF  [0805]  347.35,165.1 180 bottom
C824  0.1uF  [0805]  340.36,165.1 180 bottom
C825  0.1uF  [0805]  333.38,165.1 180 bottom
C826  0.1uF  [0805]  326.39,165.1 180 bottom
C827  0.1uF  [0805]  319.4,165.1 180 bottom
C828  0.1uF  [0805]  312.42,165.1 180 bottom
C829  0.1uF  [0805]  305.44,165.1 180 bottom
C830  0.1uF  [0805]  298.45,165.1 180 bottom
C831  0.1uF  [0805]  291.46,165.1 180 bottom
C832  0.1uF  [0805]  284.48,165.1 180 bottom
C833  0.1uF  [0805]  277.5,165.1 180 bottom
C834  0.1uF  [0805]  270.51,165.1 180 bottom
C835  0.1uF  [0805]  263.52,165.1 180 bottom
C836  0.1uF  [0805]  256.54,165.1 180 bottom
C837  0.1uF  [0805]  249.56,165.1 180 bottom
C838  0.1uF  [0805]  242.57,165.1 180 bottom
C839  0.1uF  [0805]  235.59,165.1 180 bottom
C840  0.1uF  [0805]  228.6,165.1 180 bottom
C841  0.1uF  [0805]  221.62,165.1 180 bottom
C842  0.1uF  [0805]  214.63,165.1 180 bottom
C843  0.1uF  [0805]  207.65,165.1 180 bottom
C844  0.1uF  [0805]  200.66,165.1 180 bottom
C845  0.1uF  [0805]  193.68,165.1 180 bottom
C846  0.1uF  [0805]  186.69,165.1 180 bottom
C847  0.1uF  [0805]  179.71,165.1 180 bottom
C848  0.1uF  [0805]  172.72,165.1 180 bottom
C849  0.1uF  [0805]  165.74,165.1 180 bottom
C850  0.1uF  [0805]  158.75,165.1 180 bottom
C851  0.1uF  [0805]  151.76,165.1 180 bottom
C852  0.1uF  [0805]  144.78,165.1 180 bottom
C853  0.1uF  [0805]  137.79,165.1 180 bottom
C854  0.1uF  [0805]  130.81,165.1 180 bottom
C855  0.1uF  [0805]  123.83,165.1 180 bottom
C856  0.1uF  [0805]  116.84,165.1 180 bottom
C857  0.1uF  [0805]  109.86,165.1 180 bottom
C858  0.1uF  [0805]  102.87,165.1 180 bottom
C859  0.1uF  [0805]  95.89,165.1 180 bottom
C860  0.1uF  [0805]  88.9,165.1 180 bottom
C901  0.1uF  [0805]  88.9,158.12 0 bottom
C902  0.1uF  [0805]  95.89,158.12 0 bottom
C903  0.1uF  [0805]  102.87,158.12 0 bottom
C904  0.1uF  [0805]  109.86,158.12 0 bottom
C905  0.1uF  [0805]  116.84,158.12 0 bottom
C906  0.1uF  [0805]  123.83,158.12 0 bottom
C907  0.1uF  [0805]  130.81,158.12 0 bottom
C908  0.1uF  [0805]  137.79,158.12 0 bottom
C909  0.1uF  [0805]  144.78,158.12 0 bottom
C910  0.1uF  [0805]  151.76,158.12 0 bottom
C911  0.1uF  [0805]  158.75,158.12 0 bottom
C912  0.1uF  [0805]  165.74,158.12 0 bottom
C913  0.1uF  [0805]  172.72,158.12 0 bottom
C914  0.1uF  [0805]  179.71,158.12 0 bottom
C915  0.1uF  [0805]  186.69,158.12 0 bottom
C916  0.1uF  [0805]  193.68,158.12 0 bottom
C917  0.1uF  [0805]  200.66,158.12 0 bottom
C918  0.1uF  [0805]  207.65,158.12 0 bottom
C919  0.1uF  [0805]  214.63,158.12 0 bottom
C920  0.1uF  [0805]  221.62,158.12 0 bottom
C921  0.1uF  [0805]  228.6,158.12 0 bottom
C922  0.1uF  [0805]  235.59,158.12 0 bottom
C923  0.1uF  [0805]  242.57,158.12 0 bottom
C924  0.1uF  [0805]  249.56,158.12 0 bottom
C925  0.1uF  [0805]  256.54,158.12 0 bottom
C926  0.1uF  [0805]  263.52,158.12 0 bottom
C927  0.1uF  [0805]  270.51,158.12 0 bottom
C928  0.1uF  [0805]  277.5,158.12 0 bottom
C929  0.1uF  [0805]  284.48,158.12 0 bottom
C930  0.1uF  [0805]  291.46,158.12 0 bottom
C931  0.1uF  [0805]  298.45,158.12 0 bottom
C932  0.1uF  [0805]  305.44,158.12 0 bottom
C933  0.1uF  [0805]  312.42,158.12 0 bottom
C934  0.1uF  [0805]  319.4,158.12 0 bottom
C935  0.1uF  [0805]  326.39,158.12 0 bottom
C936  0.1uF  [0805]  333.38,158.12 0 bottom
C937  0.1uF  [0805]  340.36,158.12 0 bottom
C938  0.1uF  [0805]  347.35,158.12 0 bottom
C939  0.1uF  [0805]  354.33,158.12 0 bottom
C940  0.1uF  [0805]  361.31,158.12 0 bottom
C941  0.1uF  [0805]  368.3,158.12 0 bottom
C942  0.1uF  [0805]  375.29,158.12 0 bottom
C943  0.1uF  [0805]  382.27,158.12 0 bottom
C944  0.1uF  [0805]  389.25,158.12 0 bottom
C945  0.1uF  [0805]  396.24,158.12 0 bottom
C946  0.1uF  [0805]  403.23,158.12 0 bottom
C947  0.1uF  [0805]  410.21,158.12 0 bottom
C948  0.1uF  [0805]  417.19,158.12 0 bottom
C949  0.1uF  [0805]  424.18,158.12 0 bottom
C950  0.1uF  [0805]  431.17,158.12 0 bottom
C951  0.1uF  [0805]  438.15,158.12 0 bottom
C952  0.1uF  [0805]  445.13,158.12 0 bottom
C953  0.1uF  [0805]  452.12,158.12 0 bottom
C954  0.1uF  [0805]  459.11,158.12 0 bottom
C955  0.1uF  [0805]  466.09,158.12 0 bottom
C956  0.1uF  [0805]  473.07,158.12 0 bottom
C957  0.1uF  [0805]  480.06,158.12 0 bottom
C958  0.1uF  [0805]  487.05,158.12 0 bottom
C959  0.1uF  [0805]  494.03,158.12 0 bottom
C960  0.1uF  [0805]  501.01,158.12 0 bottom
C961  0.1uF  [0805]  501.01,151.13 180 bottom
C962  0.1uF  [0805]  494.03,151.13 180 bottom
C963  0.1uF  [0805]  487.05,151.13 180 bottom
C964  0.1uF  [0805]  480.06,151.13 180 bottom
C965  0.1uF  [0805]  473.07,151.13 180 bottom
C966  0.1uF  [0805]  466.09,151.13 180 bottom
C967  0.1uF  [0805]  459.11,151.13 180 bottom
C968  0.1uF  [0805]  452.12,151.13 180 bottom
C969  0.1uF  [0805]  445.13,151.13 180 bottom
C970  0.1uF  [0805]  438.15,151.13 180 bottom
C971  0.1uF  [0805]  431.17,151.13 180 bottom
C972  0.1uF  [0805]  424.18,151.13 180 bottom
C973  0.1uF  [0805]  417.19,151.13 180 bottom
C974  0.1uF  [0805]  410.21,151.13 180 bottom
C975  0.1uF  [0805]  403.23,151.13 180 bottom
C976  0.1uF  [0805]  396.24,151.13 180 bottom
C977  0.1uF  [0805]  389.25,151.13 180 bottom
C978  0.1uF  [0805]  382.27,151.13 180 bottom
C979  0.1uF  [0805]  375.29,151.13 180 bottom
C980  0.1uF  [0805]  368.3,151.13 180 bottom
C981  0.1uF  [0805]  361.31,151.13 180 bottom
C982  0.1uF  [0805]  354.33,151.13 180 bottom
C983  0.1uF  [0805]  347.35,151.13 180 bottom
C984  0.1uF  [0805]  340.36,151.13 180 bottom
C985  0.1uF  [0805]  333.38,151.13 180 bottom
C986  0.1uF  [0805]  326.39,151.13 180 bottom
C987  0.1uF  [0805]  319.4,151.13 180 bottom
C988  0.1uF  [0805]  312.42,151.13 180 bottom
C989  0.1uF  [0805]  305.44,151.13 180 bottom
C990  0.1uF  [0805]  298.45,151.13 180 bottom
C991  0.1uF  [0805]  291.46,151.13 180 bottom
C992  0.1uF  [0805]  284.48,151.13 180 bottom
C993  0.1uF  [0805]  277.5,151.13 180 bottom
C994  0.1uF  [0805]  270.51,151.13 180 bottom
C995  0.1uF  [0805]  263.52,151.13 180 bottom
C996  0.1uF  [0805]  256.54,151.13 180 bottom
C997  0.1uF  [0805]  249.56,151.13 180 bottom
C998  0.1uF  [0805]  242.57,151.13 180 bottom
C999  0.1uF  [0805]  235.59,151.13 180 bottom
C1000  0.1uF  [0805]  228.6,151.13 180 bottom
C1001  0.1uF  [0805]  221.62,151.13 180 bottom
C1002  0.1uF  [0805]  214.63,151.13 180 bottom
C1003  0.1uF  [0805]  207.65,151.13 180 bottom
C1004  0.1uF  [0805]  200.66,151.13 180 bottom
C1005  0.1uF  [0805]  193.68,151.13 180 bottom
C1006  0.1uF  [0805]  186.69,151.13 180 bottom
C1007  0.1uF  [0805]  179.71,151.13 180 bottom
C1008  0.1uF  [0805]  172.72,151.13 180 bottom
C1009  0.1uF  [0805]  165.74,151.13 180 bottom
C1010  0.1uF  [0805]  158.75,151.13 180 bottom
C1011  0.1uF  [0805]  151.76,151.13 180 bottom
C1012  0.1uF  [0805]  144.78,151.13 180 bottom
C1013  0.1uF  [0805]  137.79,151.13 180 bottom
C1014  0.1uF  [0805]  130.81,151.13 180 bottom
C1015  0.1uF  [0805]  123.83,151.13 180 bottom
C1016  0.1uF  [0805]  116.84,151.13 180 bottom
C1017  0.1uF  [0805]  109.86,151.13 180 bottom
C1018  0.1uF  [0805]  102.87,151.13 180 bottom
C1019  0.1uF  [0805]  95.89,151.13 180 bottom
C1020  0.1uF  [0805]  88.9,151.13 180 bottom
C1061  0.1uF  [0805]  88.9,144.15 0 bottom
C1062  0.1uF  [0805]  95.89,144.15 0 bottom
C1063  0.1uF  [0805]  102.87,144.15 0 bottom
C1064  0.1uF  [0805]  109.86,144.15 0 bottom
C1065  0.1uF  [0805]  116.84,144.15 0 bottom
C1066  0.1uF  [0805]  123.83,144.15 0 bottom
C1067  0.1uF  [0805]  130.81,144.15 0 bottom
C1068  0.1uF  [0805]  137.79,144.15 0 bottom
C1069  0.1uF  [0805]  144.78,144.15 0 bottom
C1070  0.1uF  [0805]  151.76,144.15 0 bottom
C1071  0.1uF  [0805]  158.75,144.15 0 bottom
C1072  0.1uF  [0805]  165.74,144.15 0 bottom
C1073  0.1uF  [0805]  172.72,144.15 0 bottom
C1074  0.1uF  [0805]  179.71,144.15 0 bottom
C1075  0.1uF  [0805]  186.69,144.15 0 bottom
C1076  0.1uF  [0805]  193.68,144.15 0 bottom
C1077  0.1uF  [0805]  200.66,144.15 0 bottom
C1078  0.1uF  [0805]  207.65,144.15 0 bottom
C1079  0.1uF  [0805]  214.63,144.15 0 bottom
C1080  0.1uF  [0805]  221.62,144.15 0 bottom
C1081  0.1uF  [0805]  228.6,144.15 0 bottom
C1082  0.1uF  [0805]  235.59,144.15 0 bottom
C1083  0.1uF  [0805]  242.57,144.15 0 bottom
C1084  0.1uF  [0805]  249.56,144.15 0 bottom
C1085  0.1uF  [0805]  256.54,144.15 0 bottom
C1086  0.1uF  [0805]  263.52,144.15 0 bottom
C1087  0.1uF  [0805]  270.51,144.15 0 bottom
C1088  0.1uF  [0805]  277.5,144.15 0 bottom
C1089  0.1uF  [0805]  284.48,144.15 0 bottom
C1090  0.1uF  [0805]  291.46,144.15 0 bottom
C1091  0.1uF  [0805]  298.45,144.15 0 bottom
C1092  0.1uF  [0805]  305.44,144.15 0 bottom
C1093  0.1uF  [0805]  312.42,144.15 0 bottom
C1094  0.1uF  [0805]  319.4,144.15 0 bottom
C1095  0.1uF  [0805]  326.39,144.15 0 bottom
C1096  0.1uF  [0805]  333.38,144.15 0 bottom
C1097  0.1uF  [0805]  340.36,144.15 0 bottom
C1098  0.1uF  [0805]  347.35,144.15 0 bottom
C1099  0.1uF  [0805]  354.33,144.15 0 bottom
C1100  0.1uF  [0805]  361.31,144.15 0 bottom
C1101  0.1uF  [0805]  368.3,144.15 0 bottom
C1102  0.1uF  [0805]  375.29,144.15 0 bottom
C1103  0.1uF  [0805]  382.27,144.15 0 bottom
C1104  0.1uF  [0805]  389.25,144.15 0 bottom
C1105  0.1uF  [0805]  396.24,144.15 0 bottom
C1106  0.1uF  [0805]  403.23,144.15 0 bottom
C1107  0.1uF  [0805]  410.21,144.15 0 bottom
C1108  0.1uF  [0805]  417.19,144.15 0 bottom
C1109  0.1uF  [0805]  424.18,144.15 0 bottom
C1110  0.1uF  [0805]  431.17,144.15 0 bottom
C1111  0.1uF  [0805]  438.15,144.15 0 bottom
C1112  0.1uF  [0805]  445.13,144.15 0 bottom
C1113  0.1uF  [0805]  452.12,144.15 0 bottom
C1114  0.1uF  [0805]  459.11,144.15 0 bottom
C1115  0.1uF  [0805]  466.09,144.15 0 bottom
C1116  0.1uF  [0805]  473.07,144.15 0 bottom
C1117  0.1uF  [0805]  480.06,144.15 0 bottom
C1118  0.1uF  [0805]  487.05,144.15 0 bottom
C1119  0.1uF  [0805]  494.03,144.15 0 bottom
C1120  0.1uF  [0805]  501.01,144.15 0 bottom
C1121  0.1uF  [0805]  501.01,137.16 180 bottom
C1122  0.1uF  [0805]  494.03,137.16 180 bottom
C1123  0.1uF  [0805]  487.05,137.16 180 bottom
C1124  0.1uF  [0805]  480.06,137.16 180 bottom
C1125  0.1uF  [0805]  473.07,137.16 180 bottom
C1126  0.1uF  [0805]  466.09,137.16 180 bottom
C1127  0.1uF  [0805]  459.11,137.16 180 bottom
C1128  0.1uF  [0805]  452.12,137.16 180 bottom
C1129  0.1uF  [0805]  445.13,137.16 180 bottom
C1130  0.1uF  [0805]  438.15,137.16 180 bottom
C1131  0.1uF  [0805]  431.17,137.16 180 bottom
C1132  0.1uF  [0805]  424.18,137.16 180 bottom
C1133  0.1uF  [0805]  417.19,137.16 180 bottom
C1134  0.1uF  [0805]  410.21,137.16 180 bottom
C1135  0.1uF  [0805]  403.23,137.16 180 bottom
C1136  0.1uF  [0805]  396.24,137.16 180 bottom
C1137  0.1uF  [0805]  389.25,137.16 180 bottom
C1138  0.1uF  [0805]  382.27,137.16 180 bottom
C1139  0.1uF  [0805]  375.29,137.16 180 bottom
C1140  0.1uF  [0805]  368.3,137.16 180 bottom
C1141  0.1uF  [0805]  361.31,137.16 180 bottom
C1142  0.1uF  [0805]  354.33,137.16 180 bottom
C1143  0.1uF  [0805]  347.35,137.16 180 bottom
C1144  0.1uF  [0805]  340.36,137.16 180 bottom
C1145  0.1uF  [0805]  333.38,137.16 180 bottom
C1146  0.1uF  [0805]  326.39,137.16 180 bottom
C1147  0.1uF  [0805]  319.4,137.16 180 bottom
C1148  0.1uF  [0805]  312.42,137.16 180 bottom
C1149  0.1uF  [0805]  305.44,137.16 180 bottom
C1150  0.1uF  [0805]  298.45,137.16 180 bottom
C1151  0.1uF  [0805]  291.46,137.16 180 bottom
C1152  0.1uF  [0805]  284.48,137.16 180 bottom
C1153  0.1uF  [0805]  277.5,137.16 180 bottom
C1154  0.1uF  [0805]  270.51,137.16 180 bottom
C1155  0.1uF  [0805]  263.52,137.16 180 bottom
C1156  0.1uF  [0805]  256.54,137.16 180 bottom
C1157  0.1uF  [0805]  249.56,137.16 180 bottom
C1158  0.1uF  [0805]  242.57,137.16 180 bottom
C1159  0.1uF  [0805]  235.59,137.16 180 bottom
C1160  0.1uF  [0805]  228.6,137.16 180 bottom
C1161  0.1uF  [0805]  221.62,137.16 180 bottom
C1162  0.1uF  [0805]  214.63,137.16 180 bottom
C1163  0.1uF  [0805]  207.65,137.16 180 bottom
C1164  0.1uF  [0805]  200.66,137.16 180 bottom
C1165  0.1uF  [0805]  193.68,137.16 180 bottom
C1166  0.1uF  [0805]  186.69,137.16 180 bottom
C1167  0.1uF  [0805]  179.71,137.16 180 bottom
C1168  0.1uF  [0805]  172.72,137.16 180 bottom
C1169  0.1uF  [0805]  165.74,137.16 180 bottom
C1170  0.1uF  [0805]  158.75,137.16 180 bottom
C1171  0.1uF  [0805]  151.76,137.16 180 bottom
C1172  0.1uF  [0805]  144.78,137.16 180 bottom
C1173  0.1uF  [0805]  137.79,137.16 180 bottom
C1174  0.1uF  [0805]  130.81,137.16 180 bottom
C1175  0.1uF  [0805]  123.83,137.16 180 bottom
C1176  0.1uF  [0805]  116.84,137.16 180 bottom
C1177  0.1uF  [0805]  109.86,137.16 180 bottom
C1178  0.1uF  [0805]  102.87,137.16 180 bottom
C1179  0.1uF  [0805]  95.89,137.16 180 bottom
C1180  0.1uF  [0805]  88.9,137.16 180 bottom
C1221  0.1uF  [0805]  88.9,130.18 0 bottom
C1222  0.1uF  [0805]  95.89,130.18 0 bottom
C1223  0.1uF  [0805]  102.87,130.18 0 bottom
C1224  0.1uF  [0805]  109.86,130.18 0 bottom
C1225  0.1uF  [0805]  116.84,130.18 0 bottom
C1226  0.1uF  [0805]  123.83,130.18 0 bottom
C1227  0.1uF  [0805]  130.81,130.18 0 bottom
C1228  0.1uF  [0805]  137.79,130.18 0 bottom
C1229  0.1uF  [0805]  144.78,130.18 0 bottom
C1230  0.1uF  [0805]  151.76,130.18 0 bottom
C1231  0.1uF  [0805]  158.75,130.18 0 bottom
C1232  0.1uF  [0805]  165.74,130.18 0 bottom
C1233  0.1uF  [0805]  172.72,130.18 0 bottom
C1234  0.1uF  [0805]  179.71,130.18 0 bottom
C1235  0.1uF  [0805]  186.69,130.18 0 bottom
C1236  0.1uF  [0805]  193.68,130.18 0 bottom
C1237  0.1uF  [0805]  200.66,130.18 0 bottom
C1238  0.1uF  [0805]  207.65,130.18 0 bottom
C1239  0.1uF  [0805]  214.63,130.18 0 bottom
C1240  0.1uF  [0805]  221.62,130.18 0 bottom
C1241  0.1uF  [0805]  228.6,130.18 0 bottom
C1242  0.1uF  [0805]  235.59,130.18 0 bottom
C1243  0.1uF  [0805]  242.57,130.18 0 bottom
C1244  0.1uF  [0805]  249.56,130.18 0 bottom
C1245  0.1uF  [0805]  256.54,130.18 0 bottom
C1246  0.1uF  [0805]  263.52,130.18 0 bottom
C1247  0.1uF  [0805]  270.51,130.18 0 bottom
C1248  0.1uF  [0805]  277.5,130.18 0 bottom
C1249  0.1uF  [0805]  284.48,130.18 0 bottom
C1250  0.1uF  [0805]  291.46,130.18 0 bottom
C1251  0.1uF  [0805]  298.45,130.18 0 bottom
C1252  0.1uF  [0805]  305.44,130.18 0 bottom
C1253  0.1uF  [0805]  312.42,130.18 0 bottom
C1254  0.1uF  [0805]  319.4,130.18 0 bottom
C1255  0.1uF  [0805]  326.39,130.18 0 bottom
C1256  0.1uF  [0805]  333.38,130.18 0 bottom
C1257  0.1uF  [0805]  340.36,130.18 0 bottom
C1258  0.1uF  [0805]  347.35,130.18 0 bottom
C1259  0.1uF  [0805]  354.33,130.18 0 bottom
C1260  0.1uF  [0805]  361.31,130.18 0 bottom
C1261  0.1uF  [0805]  368.3,130.18 0 bottom
C1262  0.1uF  [0805]  375.29,130.18 0 bottom
C1263  0.1uF  [0805]  382.27,130.18 0 bottom
C1264  0.1uF  [0805]  389.25,130.18 0 bottom
C1265  0.1uF  [0805]  396.24,130.18 0 bottom
C1266  0.1uF  [0805]  403.23,130.18 0 bottom
C1267  0.1uF  [0805]  410.21,130.18 0 bottom
C1268  0.1uF  [0805]  417.19,130.18 0 bottom
C1269  0.1uF  [0805]  424.18,130.18 0 bottom
C1270  0.1uF  [0805]  431.17,130.18 0 bottom
C1271  0.1uF  [0805]  438.15,130.18 0 bottom
C1272  0.1uF  [0805]  445.13,130.18 0 bottom
C1273  0.1uF  [0805]  452.12,130.18 0 bottom
C1274  0.1uF  [0805]  459.11,130.18 0 bottom
C1275  0.1uF  [0805]  466.09,130.18 0 bottom
C1276  0.1uF  [0805]  473.07,130.18 0 bottom
C1277  0.1uF  [0805]  480.06,130.18 0 bottom
C1278  0.1uF  [0805]  487.05,130.18 0 bottom
C1279  0.1uF  [0805]  494.03,130.18 0 bottom
C1280  0.1uF  [0805]  501.01,130.18 0 bottom
C1281  0.1uF  [0805]  501.01,123.19 180 bottom
C1282  0.1uF  [0805]  494.03,123.19 180 bottom
C1283  0.1uF  [0805]  487.05,123.19 180 bottom
C1284  0.1uF  [0805]  480.06,123.19 180 bottom
C1285  0.1uF  [0805]  473.07,123.19 180 bottom
C1286  0.1uF  [0805]  466.09,123.19 180 bottom
C1287  0.1uF  [0805]  459.11,123.19 180 bottom
C1288  0.1uF  [0805]  452.12,123.19 180 bottom
C1289  0.1uF  [0805]  445.13,123.19 180 bottom
C1290  0.1uF  [0805]  438.15,123.19 180 bottom
C1291  0.1uF  [0805]  431.17,123.19 180 bottom
C1292  0.1uF  [0805]  424.18,123.19 180 bottom
C1293  0.1uF  [0805]  417.19,123.19 180 bottom
C1294  0.1uF  [0805]  410.21,123.19 180 bottom
C1295  0.1uF  [0805]  403.23,123.19 180 bottom
C1296  0.1uF  [0805]  396.24,123.19 180 bottom
C1297  0.1uF  [0805]  389.25,123.19 180 bottom
C1298  0.1uF  [0805]  382.27,123.19 180 bottom
C1299  0.1uF  [0805]  375.29,123.19 180 bottom
C1300  0.1uF  [0805]  368.3,123.19 180 bottom
C1301  0.1uF  [0805]  361.31,123.19 180 bottom
C1302  0.1uF  [0805]  354.33,123.19 180 bottom
C1303  0.1uF  [0805]  347.35,123.19 180 bottom
C1304  0.1uF  [0805]  340.36,123.19 180 bottom
C1305  0.1uF  [0805]  333.38,123.19 180 bottom
C1306  0.1uF  [0805]  326.39,123.19 180 bottom
C1307  0.1uF  [0805]  319.4,123.19 180 bottom
C1308  0.1uF  [0805]  312.42,123.19 180 bottom
C1309  0.1uF  [0805]  305.44,123.19 180 bottom
C1310  0.1uF  [0805]  298.45,123.19 180 bottom
C1311  0.1uF  [0805]  291.46,123.19 180 bottom
C1312  0.1uF  [0805]  284.48,123.19 180 bottom
C1313  0.1uF  [0805]  277.5,123.19 180 bottom
C1314  0.1uF  [0805]  270.51,123.19 180 bottom
C1315  0.1uF  [0805]  263.52,123.19 180 bottom
C1316  0.1uF  [0805]  256.54,123.19 180 bottom
C1317  0.1uF  [0805]  249.56,123.19 180 bottom
C1318  0.1uF  [0805]  242.57,123.19 180 bottom
C1319  0.1uF  [0805]  235.59,123.19 180 bottom
C1320  0.1uF  [0805]  228.6,123.19 180 bottom
C1321  0.1uF  [0805]  221.62,123.19 180 bottom
C1322  0.1uF  [0805]  214.63,123.19 180 bottom
C1323  0.1uF  [0805]  207.65,123.19 180 bottom
C1324  0.1uF  [0805]  200.66,123.19 180 bottom
C1325  0.1uF  [0805]  193.68,123.19 180 bottom
C1326  0.1uF  [0805]  186.69,123.19 180 bottom
C1327  0.1uF  [0805]  179.71,123.19 180 bottom
C1328  0.1uF  [0805]  172.72,123.19 180 bottom
C1329  0.1uF  [0805]  165.74,123.19 180 bottom
C1330  0.1uF  [0805]  158.75,123.19 180 bottom
C1331  0.1uF  [0805]  151.76,123.19 180 bottom
C1332  0.1uF  [0805]  144.78,123.19 180 bottom
C1333  0.1uF  [0805]  137.79,123.19 180 bottom
C1334  0.1uF  [0805]  130.81,123.19 180 bottom
C1335  0.1uF  [0805]  123.83,123.19 180 bottom
C1336  0.1uF  [0805]  116.84,123.19 180 bottom
C1337  0.1uF  [0805]  109.86,123.19 180 bottom
C1338  0.1uF  [0805]  102.87,123.19 180 bottom
C1339  0.1uF  [0805]  95.89,123.19 180 bottom
C1340  0.1uF  [0805]  88.9,123.19 180 bottom
C1381  0.1uF  [0805]  88.9,116.2 0 bottom
C1382  0.1uF  [0805]  95.89,116.2 0 bottom
C1383  0.1uF  [0805]  102.87,116.2 0 bottom
C1384  0.1uF  [0805]  109.86,116.2 0 bottom
C1385  0.1uF  [0805]  116.84,116.2 0 bottom
C1386  0.1uF  [0805]  123.83,116.2 0 bottom
C1387  0.1uF  [0805]  130.81,116.2 0 bottom
C1388  0.1uF  [0805]  137.79,116.2 0 bottom
C1389  0.1uF  [0805]  144.78,116.2 0 bottom
C1390  0.1uF  [0805]  151.76,116.2 0 bottom
C1391  0.1uF  [0805]  158.75,116.2 0 bottom
C1392  0.1uF  [0805]  165.74,116.2 0 bottom
C1393  0.1uF  [0805]  172.72,116.2 0 bottom
C1394  0.1uF  [0805]  179.71,116.2 0 bottom
C1395  0.1uF  [0805]  186.69,116.2 0 bottom
C1396  0.1uF  [0805]  193.68,116.2 0 bottom
C1397  0.1uF  [0805]  200.66,116.2 0 bottom
C1398  0.1uF  [0805]  207.65,116.2 0 bottom
C1399  0.1uF  [0805]  214.63,116.2 0 bottom
C1400  0.1uF  [0805]  221.62,116.2 0 bottom
C1401  0.1uF  [0805]  228.6,116.2 0 bottom
C1402  0.1uF  [0805]  235.59,116.2 0 bottom
C1403  0.1uF  [0805]  242.57,116.2 0 bottom
C1404  0.1uF  [0805]  249.56,116.2 0 bottom
C1405  0.1uF  [0805]  256.54,116.2 0 bottom
C1406  0.1uF  [0805]  263.52,116.2 0 bottom
C1407  0.1uF  [0805]  270.51,116.2 0 bottom
C1408  0.1uF  [0805]  277.5,116.2 0 bottom
C1409  0.1uF  [0805]  284.48,116.2 0 bottom
C1410  0.1uF  [0805]  291.46,116.2 0 bottom
C1411  0.1uF  [0805]  298.45,116.2 0 bottom
C1412  0.1uF  [0805]  305.44,116.2 0 bottom
C1413  0.1uF  [0805]  312.42,116.2 0 bottom